# Altium schematic sheet SOM_Power.SchDoc
size A4
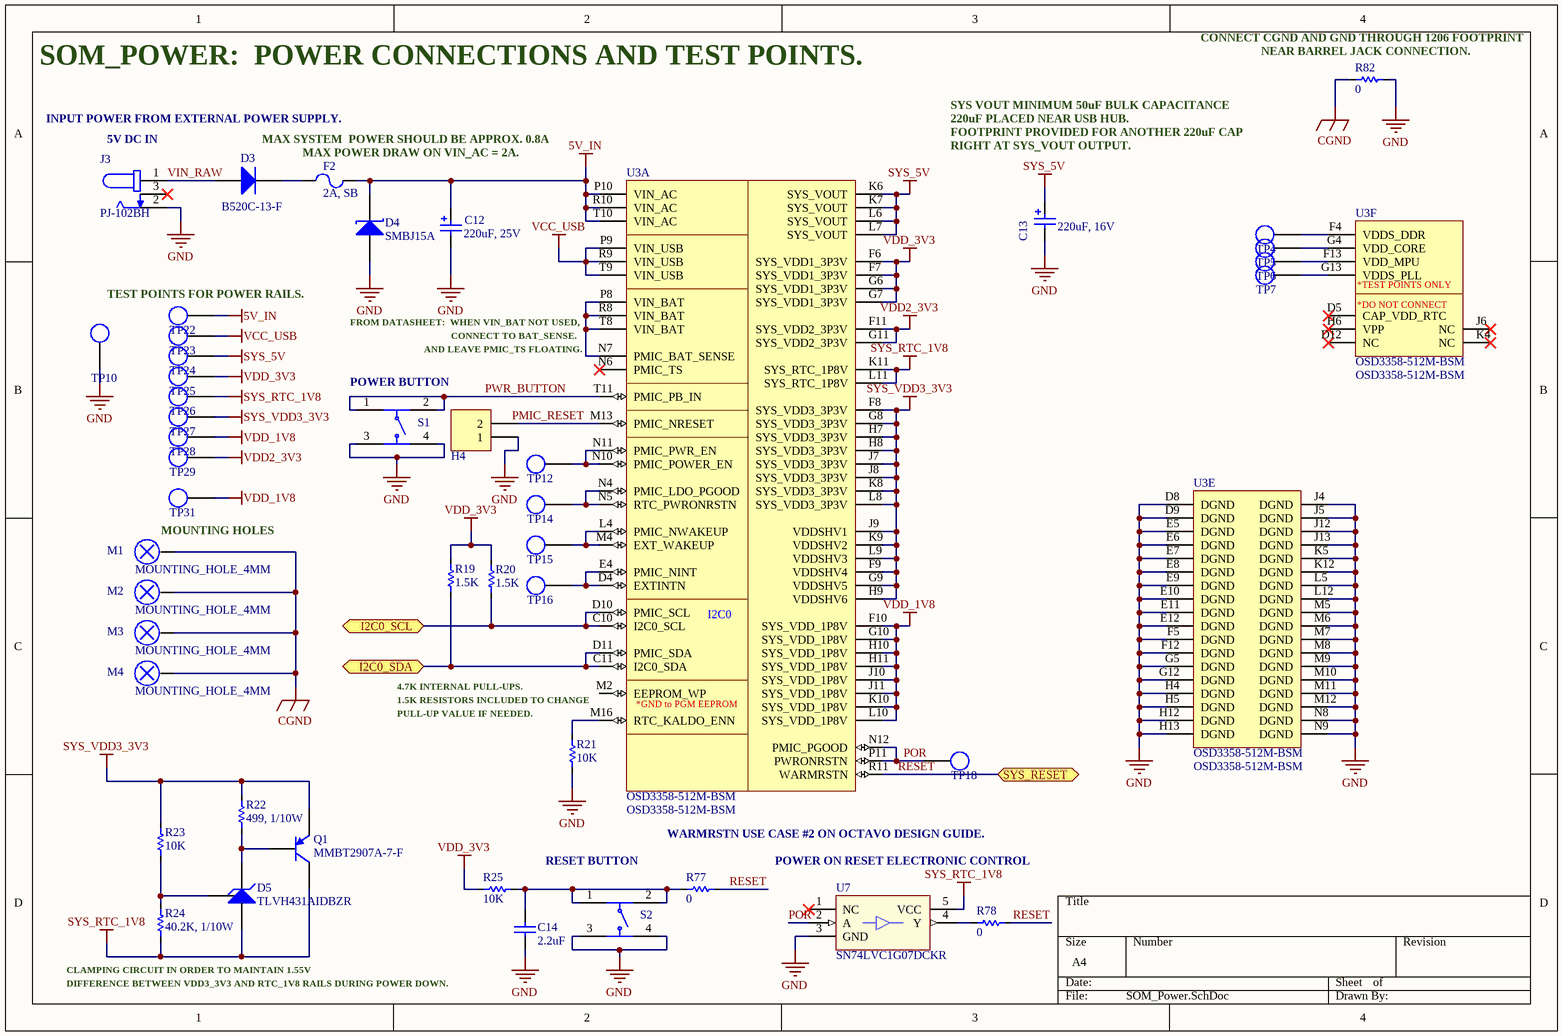
[diagram p0: SOM_Power.SchDoc]

## Parts
C12  220uF, 25V  [CAP_SMD_6.3x7.7]
C13  220uF, 16V  [CAP_SMD_6.3x7.7]
C14  2.2uF  [CAP_0603]
D3  B520C-13-F  [D0-214AA]
D4  SMBJ15A  [D0-214AA]
D5  TLVH431AIDBZR  [SOT-23-3]
F2  2A, SB  [CAP_0603]
H4  02p  [HEADER_2X1_2.54MM]  (value not drawn)
J3  PJ-102BH  [PJ-102BH]
M1  MOUNTING_HOLE_4MM  [MOUNTING_HOLE_4MM]
M2  MOUNTING_HOLE_4MM  [MOUNTING_HOLE_4MM]
M3  MOUNTING_HOLE_4MM  [MOUNTING_HOLE_4MM]
M4  MOUNTING_HOLE_4MM  [MOUNTING_HOLE_4MM]
Q1  MMBT2907A-7-F  [SOT-23-3]
R19  1.5K  [RES_0603]
R20  1.5K  [RES_0603]
R21  10K  [RES_0603]
R22  499, 1/10W  [RES_0603]
R23  10K  [RES_0603]
R24  40.2K, 1/10W  [RES_0603]
R25  10K  [RES_0603]
R77  0  [RES_0603]
R78  0  [RES_0603]
R82  0  [RES_1206]
S1  PTS645SM43SMTR92 LFS  [SWITCH_6x6MM_SMT]  (value not drawn)
S2  PTS645SM43SMTR92 LFS  [SWITCH_6x6MM_SMT]  (value not drawn)
TP4  TP_SMD  [TP_SMD]  (value not drawn)
TP5  TP_SMD  [TP_SMD]  (value not drawn)
TP6  TP_SMD  [TP_SMD]  (value not drawn)
TP7  TP_SMD  [TP_SMD]  (value not drawn)
TP10  TP_SMD  [TP_SMD]  (value not drawn)
TP12  TP_SMD  [TP_SMD]  (value not drawn)
TP14  TP_SMD  [TP_SMD]  (value not drawn)
TP15  TP_SMD  [TP_SMD]  (value not drawn)
TP16  TP_SMD  [TP_SMD]  (value not drawn)
TP18  TP_SMD  [TP_SMD]  (value not drawn)
TP22  TP_SMD  [TP_SMD]  (value not drawn)
TP23  TP_SMD  [TP_SMD]  (value not drawn)
TP24  TP_SMD  [TP_SMD]  (value not drawn)
TP25  TP_SMD  [TP_SMD]  (value not drawn)
TP26  TP_SMD  [TP_SMD]  (value not drawn)
TP27  TP_SMD  [TP_SMD]  (value not drawn)
TP28  TP_SMD  [TP_SMD]  (value not drawn)
TP29  TP_SMD  [TP_SMD]  (value not drawn)
TP31  TP_SMD  [TP_SMD]  (value not drawn)
U3  OSD3358-512M-BSM  [BGA256C127P16X16_2100X2100X308]  (parts A,E,F of 6)
U7  SN74LVC1G07DCKR  [SC70]

## Ports
I2C0_SCL (bidir), I2C0_SDA (bidir), SYS_RESET (bidir)

## Nets
5V_IN: C12.2(P) D4.2(K) F2.2 TP22.1 U3.P10(VIN_AC) U3.R10(VIN_AC) U3.T10(VIN_AC)
CGND: M1.1 M2.1 M3.1 M4.1 R82.1
GND: C12.1(N) C13.1(N) C14.1 D4.1(A) H4.1 J3.2 R21.1 R82.2 S1.3 S1.4 S2.3 S2.4 TP10.1 U3.D8(DGND) U3.D9(DGND) U3.E5(DGND) U3.E6(DGND) U3.E7(DGND) U3.E8(DGND) U3.E9(DGND) U3.E10(DGND) U3.E11(DGND) U3.E12(DGND) U3.F5(DGND) U3.F12(DGND) U3.G5(DGND) U3.G12(DGND) U3.H4(DGND) U3.H5(DGND) U3.H12(DGND) U3.H13(DGND) U3.J4(DGND) U3.J5(DGND) U3.J12(DGND) U3.J13(DGND) U3.K5(DGND) U3.K12(DGND) U3.L5(DGND) U3.L12(DGND) U3.M5(DGND) U3.M6(DGND) U3.M7(DGND) U3.M8(DGND) U3.M9(DGND) U3.M10(DGND) U3.M11(DGND) U3.M12(DGND) U3.N8(DGND) U3.N9(DGND) U7.3(GND)
SYS_5V: C13.2(P) TP24.1 U3.K6(SYS_VOUT) U3.K7(SYS_VOUT) U3.L6(SYS_VOUT) U3.L7(SYS_VOUT)
SYS_RTC_1V8: D5.3(A) Q1.3(C) R24.1 TP26.1 U3.K11(SYS_RTC_1P8V) U3.L11(SYS_RTC_1P8V) U7.5(VCC)
SYS_VDD3_3V3: Q1.2(E) R22.2 R23.2 TP27.1 U3.F8(SYS_VDD3_3P3V) U3.F9(VDDSHV4) U3.G8(SYS_VDD3_3P3V) U3.G9(VDDSHV5) U3.H7(SYS_VDD3_3P3V) U3.H8(SYS_VDD3_3P3V) U3.H9(VDDSHV6) U3.J7(SYS_VDD3_3P3V) U3.J8(SYS_VDD3_3P3V) U3.J9(VDDSHV1) U3.K8(SYS_VDD3_3P3V) U3.K9(VDDSHV2) U3.L8(SYS_VDD3_3P3V) U3.L9(VDDSHV3)
VCC_USB: TP23.1 U3.P9(VIN_USB) U3.R9(VIN_USB) U3.T9(VIN_USB)
VDD2_3V3: TP29.1 U3.F11(SYS_VDD2_3P3V) U3.G11(SYS_VDD2_3P3V)
VDD_1V8: TP28.1 TP31.1 U3.F10(SYS_VDD_1P8V) U3.G10(SYS_VDD_1P8V) U3.H10(SYS_VDD_1P8V) U3.H11(SYS_VDD_1P8V) U3.J10(SYS_VDD_1P8V) U3.J11(SYS_VDD_1P8V) U3.K10(SYS_VDD_1P8V) U3.L10(SYS_VDD_1P8V)
VDD_3V3: R19.2 R20.2 R25.2 TP25.1 U3.F6(SYS_VDD1_3P3V) U3.F7(SYS_VDD1_3P3V) U3.G6(SYS_VDD1_3P3V) U3.G7(SYS_VDD1_3P3V)
I2C0_SCL: R20.1 U3.C10(I2C0_SCL) U3.D10(PMIC_SCL) ; port I2C0_SCL
I2C0_SDA: R19.1 U3.C11(I2C0_SDA) U3.D11(PMIC_SDA) ; port I2C0_SDA
PMIC_RESET: H4.2 U3.M13(PMIC_NRESET)
POR: TP18.1 U3.N12(PMIC_PGOOD) U3.P11(PWRONRSTN) U7.2(A)
PWR_BUTTON: S1.1 S1.2 U3.T11(PMIC_PB_IN)
RESET: R77.2 R78.2 U3.R11(WARMRSTN) ; port SYS_RESET
VIN_RAW: D3.1(A) J3.1
NetC14_2: C14.2 R25.1 R77.1 S2.1 S2.2
NetD3_2: D3.2(K) F2.1
NetD5_1: D5.1(C) Q1.1(B) R22.1
NetD5_2: D5.2(REF) R23.1 R24.2
NetR21_2: R21.2 U3.M16(RTC_KALDO_ENN)
NetR78_1: R78.1 U7.4(Y)
NetTP4_1: TP4.1 U3.F4(VDDS_DDR)
NetTP5_1: TP5.1 U3.G4(VDD_CORE)
NetTP6_1: TP6.1 U3.F13(VDD_MPU)
NetTP7_1: TP7.1 U3.G13(VDDS_PLL)
NetTP12_1: TP12.1 U3.N10(PMIC_POWER_EN) U3.N11(PMIC_PWR_EN)
NetTP14_1: TP14.1 U3.N4(PMIC_LDO_PGOOD) U3.N5(RTC_PWRONRSTN)
NetTP15_1: TP15.1 U3.L4(PMIC_NWAKEUP) U3.M4(EXT_WAKEUP)
NetTP16_1: TP16.1 U3.D4(EXTINTN) U3.E4(PMIC_NINT)
NetU3_N7: U3.N7(PMIC_BAT_SENSE) U3.P8(VIN_BAT) U3.R8(VIN_BAT) U3.T8(VIN_BAT)

Not connected (* = marked no-connect by the designer): J3 3*; U3 D5(CAP_VDD_RTC)* D12(NC)* H6(VPP)* J6(NC)* K4(NC)* M2(EEPROM_WP) N6(PMIC_TS)*; U7 1(NC)*

## Notes on the sheet
- (near R82) CONNECT CGND AND GND THROUGH 1206 FOOTPRINT
- SOM_POWER:  POWER CONNECTIONS AND TEST POINTS.
- SYS VOUT MINIMUM 50uF BULK CAPACITANCE
- (near R82) NEAR BARREL JACK CONNECTION.
- INPUT POWER FROM EXTERNAL POWER SUPPLY.
- (near J3) 5V DC IN
- MAX SYSTEM  POWER SHOULD BE APPROX. 0.8A
- (near F2) MAX POWER DRAW ON VIN_AC = 2A.
- 220uF PLACED NEAR USB HUB.
- FOOTPRINT PROVIDED FOR ANOTHER 220uF CAP
- RIGHT AT SYS_VOUT OUTPUT.
- (near TP22) TEST POINTS FOR POWER RAILS.
- FROM DATASHEET:  WHEN VIN_BAT NOT USED,
- (near S1) POWER BUTTON
- AND LEAVE PMIC_TS FLOATING.
- CONNECT TO BAT_SENSE.
- (near M1) MOUNTING HOLES
- 4.7K INTERNAL PULL-UPS.
- (near R21) 1.5K RESISTORS INCLUDED TO CHANGE
- PULL-UP VALUE IF NEEDED.
- WARMRSTN USE CASE #2 ON OCTAVO DESIGN GUIDE.
- RESET BUTTON
- POWER ON RESET ELECTRONIC CONTROL
- (near R24) CLAMPING CIRCUIT IN ORDER TO MAINTAIN 1.55V
- (near R24) DIFFERENCE BETWEEN VDD3_3V3 AND RTC_1V8 RAILS DURING POWER DOWN.
- (in symbol SOM-OSD3358-512M-BSM, part A) I2C0; *GND to PGM EEPROM
- (in symbol SOM-OSD3358-512M-BSM, part F) *TEST POINTS ONLY; *DO NOT CONNECT

## Library data of the parts
C12 = UCM1E221MCL1GS: CAP ALUM 220UF 20% 25V SMD; Manufacturer: Nichicon; Rated Voltage: 25 VDC; ComponentLink1Description: Manufacturer; ComponentLink1URL: http://www.we-online.de; ComponentLink2Description: Datasheet; ComponentLink2URL: https://katalog.we-online.com/pbs/datasheet/865080345012.pdf; Mounting Technology: SMD; Value: 220uF; Manufacturer Part No.: UCM1E221MCL1GS; Tolerance: 20%; Datasheet: https://www.nichicon.co.jp/english/products/pdfs/e-ucm.pdf; Supplier: Digi-Key; Supplier Part No.: 493-14530-1-ND; Package Description: 220µF 25V Aluminum Electrolytic Capacitors Radial, Can - SMD  2000 Hrs @ 105°C
C13 = 865080345012: CAP 220 UF 20% 16 V; Manufacturer: Wurth Elektronik; Rated Voltage: 16 VDC; ComponentLink1Description: Manufacturer; ComponentLink1URL: http://www.we-online.de; ComponentLink2Description: Datasheet; ComponentLink2URL: https://katalog.we-online.com/pbs/datasheet/865080345012.pdf; Mounting Technology: SMD; Value: 220uF; Manufacturer Part No.: 865080345012; Tolerance: 20%; Datasheet: *; Supplier: Digi-Key; Package Reference: CAP_SMD_6.3x7.7; Supplier Part No.: 732-8422-1-ND; Package Description: CAP_SMD_6.3x7.7
C14 = C0603C225M4PAC7867: CAP CER 2.2UF 16V X5R 0603; Manufacturer: KEMET; Manufacturer Part No.: C0603C104M4RACTU; Tolerance: 20%; ComponentLink1Description: Manufacturer; ComponentLink1URL: http://www.we-online.de; Value: 2.2uF; Rated Voltage: 16V; Ceramic Type: X5R; Supplier Part No.: 399-13136-1-ND; Package Reference: CAP_0603; Package Description: 0603; Mounting Technology: SMD; Datasheet: https://content.kemet.com/datasheets/KEM_C1002_X7R_SMD.pdf; Supplier: Digi-Key; ComponentLink2Description: Datasheet; ComponentLink2URL: https://content.kemet.com/datasheets/KEM_C1002_X7R_SMD.pdf
D3 = B520C-13-F: DIODE SCHOTTKY 20V 5A SMC; Manufacturer: Diodes Incorporated; Manufacturer Part No.: B520C-13-F; Package Description: Diode Schottky 20V 5A Surface Mount SMC; Package Reference: D0-214AA; Supplier: Digi-Key; Mounting Technology: SMD; Supplier Part No.: B520C-FDICT-ND; Datasheet: https://www.littelfuse.com/~/media/electronics/datasheets/tvs_diodes/littelfuse_tvs_diode_smbj_datasheet.pdf.pdf
D4 = SMBJ15A: TVS DIODE 15V 24.4V DO214AA; Manufacturer: Littelfuse Inc.; Manufacturer Part No.: SMBJ15A; Package Description: 24.4V Clamp 24.6A Ipp Tvs Diode Surface Mount DO-214AA (SMBJ); Package Reference: *; Supplier: Digi-Key; Mounting Technology: SMD; Supplier Part No.: SMBJ15ALFCT-ND; Datasheet: https://www.littelfuse.com/~/media/electronics/datasheets/tvs_diodes/littelfuse_tvs_diode_smbj_datasheet.pdf.pdf
D5 = TLVH431AIDBZR: IC VREF SHUNT 18V 1% SOT23-3; Manufacturer: Texas Instruments; Package Reference: SOT-23-3; Package Description: Shunt Voltage Reference IC 18V ±1%  SOT-23-3; Manufacturer Part No.: TLVH431AIDBZR; Supplier: Digi-Key; Datasheet: https://www.ti.com/lit/ds/symlink/tlvh431a.pdf; Supplier Part No.: 296-17970-1-ND; Mounting Technology: SMD
F2 = SF-0603S200-2: FUSE BOARD MOUNT 2A 32VDC 0603; Manufacturer: Bourns Inc.; ComponentLink1Description: Manufacturer Link; ComponentLink1URL: http://www.littelfuse.com/cgi-bin/r.cgi/en/brand_wickmann.html?LFSESSION=wIUUW1TXzO; ComponentLink2Description: Data Sheet; ComponentLink2URL: R:\Eclipse\ELE\PDF\Wickmann\Fuse TE-5 395.pdf; Date: 2020; Supplier: Digi-Key; Supplier Part No.: SF-0603S200-2CT-ND; Manufacturer Part No.: SF-0603S200-2; Mounting Technology: SMD; Package Description: 2A  AC 32V DC Fuse Board Mount (Cartridge Style Excluded) Surface Mount 0603 (1608 Metric); Package Reference: CAP_0603
H4 = 61300211121: CONN HEADER VERT 2POS 2.54MM; Manufacturer: Wurth Elektronik; ComponentLink1Description: Manufacturer; ComponentLink1URL: http://www.we-online.de; ComponentLink2Description: Datasheet; ComponentLink2URL: http://katalog.we-online.de/em/datasheet/6130xx11121.pdf; Supplier Part No.: 732-5315-ND; Supplier: Digi-Key; Package Reference: HEADER_2X1_2.54MM; Package Description: Header 2-pin 2.54mm 100mils; Mounting Technology: THRU; Manufacturer Part No.: 61300211121; Datasheet: https://www.we-online.de/katalog/datasheet/6130xx11121.pdf
J3 = PJ-102BH: CONN PWR JACK 2.5X5.5MM SOLDER; Manufacturer: CUI Devices; Current: 5A; Supplier Part No.: CP-102BH-ND; Manufacturer Part No.: PJ-102BH; Package Description: Power Barrel Connector Jack 2.50mm ID (0.098"), 5.50mm OD (0.217") Through Hole, Right Angle; Package Reference: PJ-102BH; Mounting Technology: THRU; Datasheet: https://www.cuidevices.com/product/resource/pj-102bh.pdf; Supplier: Digi-Key
Q1 = MMBT2907A: TRANS PNP 60V 0.6A SOT23-3; Manufacturer: Diodes Incorporated; Manufacturer Part No.: MMBT2907A-7-F; Supplier: Digi-Key; Mounting Technology: SMD; Supplier Part No.: MMBT2907A-FDICT-ND; Package Reference: SOT-23-3; Package Description: Bipolar (BJT) Transistor PNP 60V 600mA 200MHz 300mW Surface Mount SOT-23-3; Datasheet: https://media.digikey.com/pdf/Data%20Sheets/Diodes%20PDFs/MMBT2907A_Rev2016.pdf; Current: 0.6A
R19 R20 = RC0603FR-071K5L: RES SMD 1.5K OHM 1% 1/10W 0603; Manufacturer: Yageo; Tolerance: 1%; Manufacturer Part No.: RC0603FR-071K5L; Date: 2020; ComponentLink1Description: Manufacturer Link; ComponentLink1URL: http://www.vishay.com/company/brands/dale/; ComponentLink2Description: Datasheet; ComponentLink2URL: http://www.vishay.com/docs/20035/dcrcwe3.pdf; Supplier: Digikey; Supplier Part No.: 311-1.50KHRCT-ND; Datasheet: https://www.yageo.com/upload/media/product/productsearch/datasheet/rchip/PYu-RC_Group_51_RoHS_L_10.pdf; Package Reference: RES_0603; Package Description: 0603; Mounting Technology: SMD; Value: 1.5K; Power Rating: 1/10W
R21 R23 R25 = RC0603FR-0710KL: RES SMD 10K OHM 1% 1/10W 0603; Manufacturer: Yageo; Tolerance: 1%; Manufacturer Part No.: RC0603FR-0710KL; Date: 2020; ComponentLink1Description: Manufacturer Link; ComponentLink1URL: http://www.vishay.com/company/brands/dale/; ComponentLink2Description: Datasheet; ComponentLink2URL: http://www.vishay.com/docs/20035/dcrcwe3.pdf; Supplier: Digikey; Supplier Part No.: 311-10.0KHRCT-ND; Datasheet: https://www.yageo.com/upload/media/product/productsearch/datasheet/rchip/PYu-RC_Group_51_RoHS_L_10.pdf; Package Reference: RES_0603; Package Description: 0603; Mounting Technology: SMD; Value: 10K; Power Rating: 1/10W
R22 = RC0603FR-07499RL: RES SMD 499 OHM 1% 1/10W 0603; Manufacturer: Yageo; Value: 499; Tolerance: 1%; Manufacturer Part No.: RC0603FR-07499RL; Date: 2020; ComponentLink1Description: Manufacturer Link; ComponentLink1URL: http://www.vishay.com/company/brands/dale/; ComponentLink2Description: Datasheet; ComponentLink2URL: http://www.vishay.com/docs/20035/dcrcwe3.pdf; Supplier: Digikey; Supplier Part No.: 311-499HRCT-ND; Datasheet: https://www.yageo.com/upload/media/product/productsearch/datasheet/rchip/PYu-RC_Group_51_RoHS_L_10.pdf; Package Reference: RES_0603; Package Description: 0603; Mounting Technology: SMD; Power Rating: 1/10W
R24 = RC0603FR-0740K2L: RES SMD 40.2K OHM 1% 1/10W 0603; Manufacturer: Yageo; Tolerance: 1%; Manufacturer Part No.: RC0603FR-0740K2L; Date: 2020; ComponentLink1Description: Manufacturer Link; ComponentLink1URL: http://www.vishay.com/company/brands/dale/; ComponentLink2Description: Datasheet; ComponentLink2URL: http://www.vishay.com/docs/20035/dcrcwe3.pdf; Supplier: Digikey; Supplier Part No.: 311-40.2KHRCT-ND; Datasheet: https://www.yageo.com/upload/media/product/productsearch/datasheet/rchip/PYu-RC_Group_51_RoHS_L_10.pdf; Package Reference: RES_0603; Package Description: 0603; Mounting Technology: SMD; Value: 40.2K; Power Rating: 1/10W
R77 R78 = RC0603JR-070RL: RES SMD 0 OHM JUMPER 1/10W 0603; Manufacturer: Yageo; Manufacturer Part No.: RC0603JR-070RL; Date: 2020; ComponentLink1Description: Manufacturer Link; ComponentLink1URL: http://www.vishay.com/company/brands/dale/; ComponentLink2Description: Datasheet; ComponentLink2URL: http://www.vishay.com/docs/20035/dcrcwe3.pdf; Supplier: Digikey; Supplier Part No.: 311-0.0GRCT-ND; Datasheet: https://www.yageo.com/upload/media/product/productsearch/datasheet/rchip/PYu-RC_Group_51_RoHS_L_10.pdf; Package Reference: RES_0603; Package Description: 0603; Mounting Technology: SMD; Value: 0; Power Rating: 1/10W
R82 = WSL120600000ZEA9: RES 0 OHM JUMPER 1206; Manufacturer: Vishay Dale; Power Rating: 1/4W; Tolerance: 0; Manufacturer Part No.: WSL120600000ZEA9; Date: 2020; ComponentLink1Description: Manufacturer Link; ComponentLink1URL: http://www.vishay.com/company/brands/dale/; ComponentLink2Description: Datasheet; ComponentLink2URL: http://www.vishay.com/docs/20035/dcrcwe3.pdf; Supplier: Digikey; Supplier Part No.: 541-3929-1-ND; Datasheet: http://www.vishay.com/docs/30192/wsl-9.pdf; Package Reference: RES_1206; Package Description: 1206; Mounting Technology: SMD; Value: 0
S1 S2 = PTS645SM43SMTR92 LFS: SWITCH TACTILE SPST-NO 0.05A 12V; Manufacturer: C&K; ComponentLink1Description: Manufacturer; ComponentLink1URL: http://www.we-online.de; ComponentLink2Description: Datasheet; ComponentLink2URL: http://katalog.we-online.de/em/datasheet/4301x2xxx8x6.pdf; Supplier: Digikey; Supplier Part No.: CKN9112CT-ND; Manufacturer Part No.: PTS645SM43SMTR92 LFS; Package Description: 6x6mm SMT Switch, 4.3mm height; Mounting Technology: SMD; Datasheet: https://dznh3ojzb2azq.cloudfront.net/products/Tactile/PTS645/documents/datasheet.pdf; Package Reference: SWITCH_6x6MM_SMT
U3 = SOM-OSD3358-512M-BSM: OSD3358-512M-BSM , 256-FBGA, 21mmx21mmx3mm; Manufacturer: Octavo Systems; Package: FBGA; Pin Count: 256-ball; Mounting Technology: SMD; ComponentLink1Description: Manufacturer URL; ComponentLink1URL: http://www.octavosystems.com/; PartNumber: OSD3358-512M-BSM; Package Description: 256-Ball Grid Array, 21x21x3 mm, Pitch 1.27 mm; Package Reference: FBGA-256; Supplier: Digi-Key; Supplier Part No.: 1676-1002-ND
U7 = SN74LVC1G07DCKR: IC BUF NON-INVERT 5.5V SC70-5; Manufacturer: Texas Instruments; Supplier: Digi-Key; Supplier Part No.: 296-8486-1-ND; Manufacturer Part No.: SN74LVC1G07DCKR; Mounting Technology: SMD; Package Reference: *; Package Description: Buffer, Non-Inverting 1 Element 1 Bit per Element Open Drain Output SC-70-5; ComponentLink1Description: Datasheet; ComponentLink1URL: https://www.ti.com/lit/ds/symlink/sn74lvc1g07.pdf